# EAGLE schematic Assignment1_Q3_fixed (EAGLE 9.5.2)
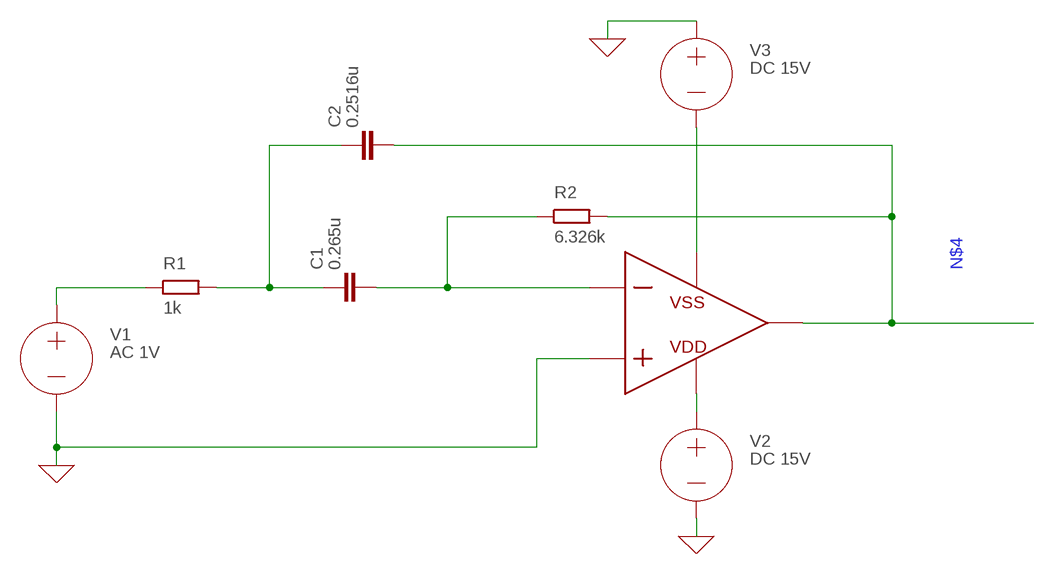
[diagram p0: schematic, sheet 1]

## Parts
C1  0.265u  C  (no package)
C2  0.2516u  C  (no package)
R1  1k  R  (no package)
R2  6.326k  R  (no package)
V1  AC 1V  VOLTAGE  (no package)
V2  DC 15V  VOLTAGE  (no package)
V3  DC 15V  VOLTAGE  (no package)
X1  OPAMP  (no package)

## Nets
0: V1.- V2.- V3.+ X1.P ; supply symbol labelled GND
N$1: R1.1 V1.+
N$2: C1.1 C2.1 R1.2
N$3: C1.2 R2.1 X1.N
N$4: C2.2 R2.2 X1.VOUT
N$5: V3.- X1.VSS
N$6: V2.+ X1.VDD

## Library data of the parts
C1 C2 = ngspice-simulation:C: CAPACITOR
R1 R2 = ngspice-simulation:R: RESISTOR
V1-V3 = ngspice-simulation:VOLTAGE: Independent Voltage Source, either DC, AC, PULSE, SINE, PWL, EXP, or SFFM; VALUE: 0V
X1 = ngspice-simulation:OPAMP: Operational amplifier with power pins